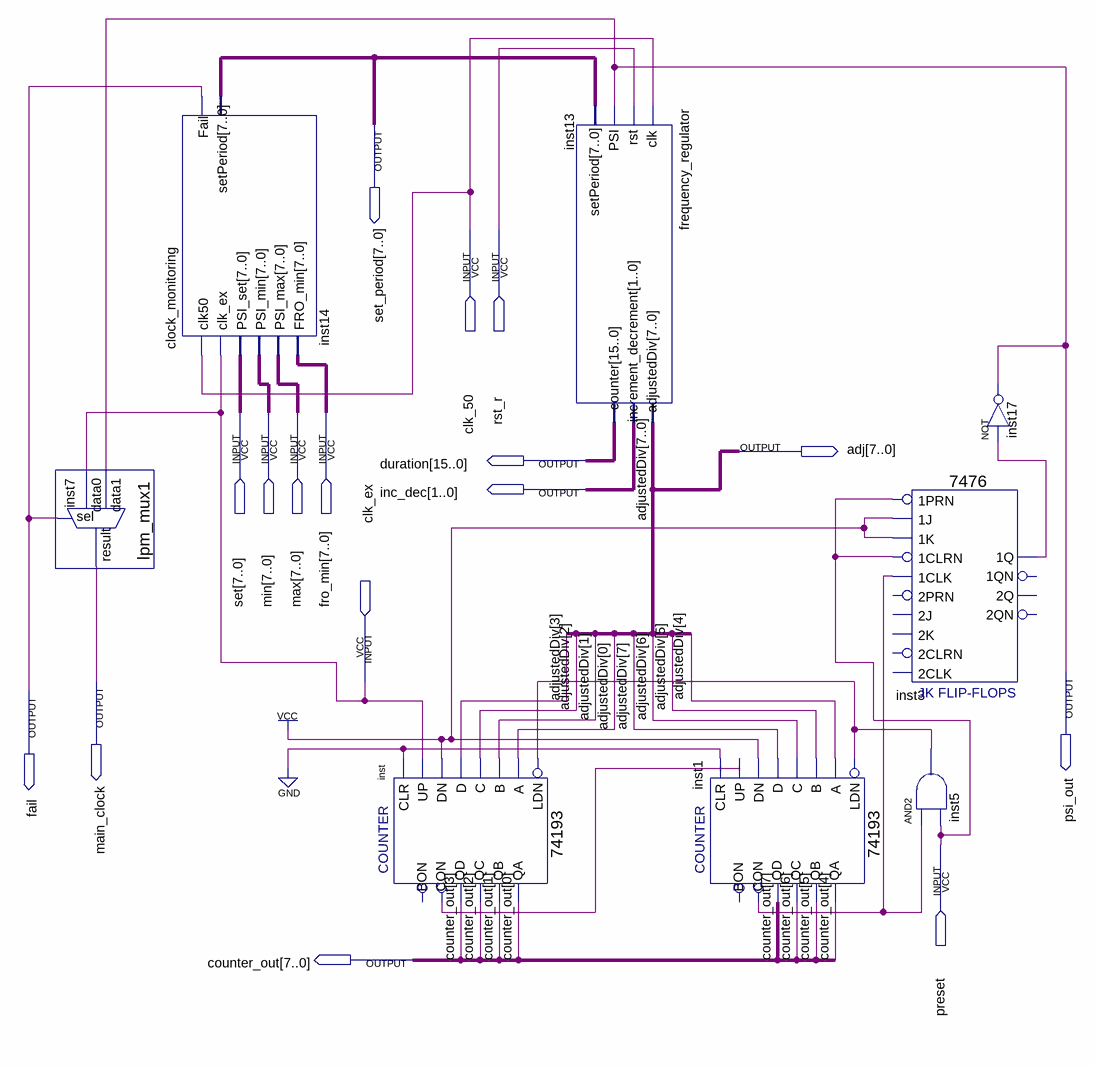
[diagram p0: schematic sheet]
// Quartus schematic monitor.bdf as structural Verilog: 8 symbols, 16 pins
module monitor (
  input  clk_50,
  input  rst_r,
  input  [7:0] set,
  input  [7:0] min,
  input  [7:0] max,
  input  [7:0] fro_min,
  input  clk_ex,
  input  preset,
  output [7:0] set_period,
  output [7:0] adj,
  output [15:0] duration,
  output [1:0] inc_dec,
  output psi_out,
  output main_clock,
  output fail,
  output [7:0] counter_out
);

  wire inst1_con, inst3_1q, inst5_out, inst_con;

  lpm_mux1 inst7 (.data1(psi_out), .data0(clk_ex), .sel(fail), .result(main_clock));
  clock_monitoring inst14 (
    .clk50(clk_50), .clk_ex(clk_ex), .PSI_set(set), .PSI_min(min), .PSI_max(max), .FRO_min(fro_min),
    .Fail(fail), .setPeriod(set_period));
  \74193  inst (
    .D(adj[3]), .C(adj[2]), .B(adj[1]), .A(adj[0]), .CLR(1'b0), .UP(clk_ex), .DN(1'b1), .LDN(inst5_out),
    .QB(counter_out[1]), .QA(counter_out[0]), .CON(inst_con), .QD(counter_out[3]), .QC(counter_out[2]));  // open: BON
  frequency_regulator inst13 (
    .clk(clk_50), .rst(rst_r), .PSI(psi_out), .setPeriod(set_period), .adjustedDiv(adj),
    .increment_decrement(inc_dec), .counter(duration));
  \74193  inst1 (
    .D(adj[7]), .C(adj[6]), .B(adj[5]), .A(adj[4]), .CLR(1'b0), .UP(inst_con), .DN(1'b1), .LDN(inst5_out),
    .QB(counter_out[5]), .QA(counter_out[4]), .CON(inst1_con), .QD(counter_out[7]), .QC(counter_out[6]));  // open: BON
  \7476  inst3 (
    .\1J (1'b1), .\1K (1'b1), .\1PRN (preset), .\1CLK (inst1_con), .\1CLRN (preset), .\1Q (inst3_1q));  // open: 2PRN, 2J, 2K, 2CLRN, 2CLK, 2QN, 2Q, 1QN
  and inst5 (inst5_out, inst1_con, preset);
  not inst17 (psi_out, inst3_1q);

  // Other names for the same wires on the sheet: adjustedDiv[7:0] = adj
endmodule
